# EAGLE schematic LMT70 (EAGLE 7.3.0)
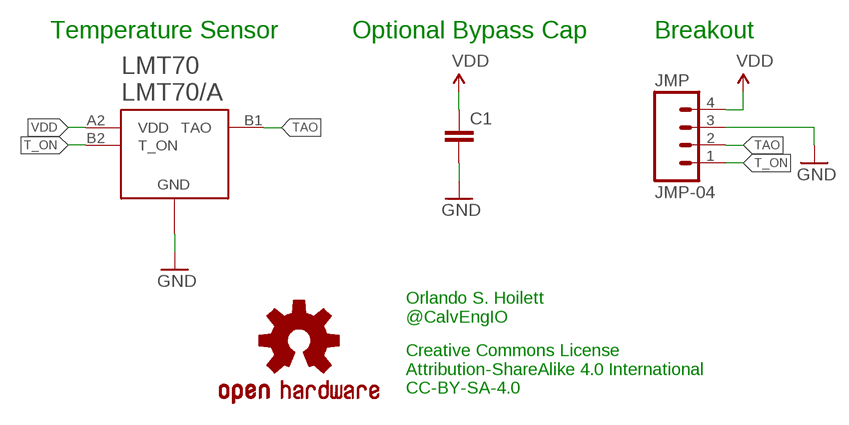
[diagram p0: schematic, sheet 1]

## Parts
C1  C-EUC0402  [C0402]
JMP  JMP-04  [JMP-04]
LMT70  LMT70/A  [4-DSBGA]
LOGO1  OSHW-LOGOM  [OSHW-LOGO-M]

## Nets
GND: C1.2 JMP.3 LMT70.A1(GND)
T_ON: JMP.1 LMT70.B2(T_ON)
TAO: JMP.2 LMT70.B1(TAO)
VDD: C1.1 JMP.4 LMT70.A2(VDD)

## Notes on the sheet
- Temperature Sensor | Optional Bypass Cap | Breakout
- Orlando S. Hoilett
  @CalvEngIO
- Creative Commons License
  Attribution-ShareAlike 4.0 International 
  CC-BY-SA-4.0

## Library data of the parts
C1 = resistor:C-EU: CAPACITOR, European symbol
JMP = CalvEngIO-Connectors:JMP-04
LMT70 = CalvEngIO-Sensors:LMT70/A
LOGO1 = SparkFun-Aesthetics:OSHW-LOGO: Open Source Hardware Logo This logo indicates the piece of hardware it is found on incorporates a OSHW license and/or adheres to the definition of open source hardware found here: http://freedomdefined.org/OSHW